# EAGLE design DIGISPARK_PRODUCTION_REV3 (EAGLE 9.6.2)
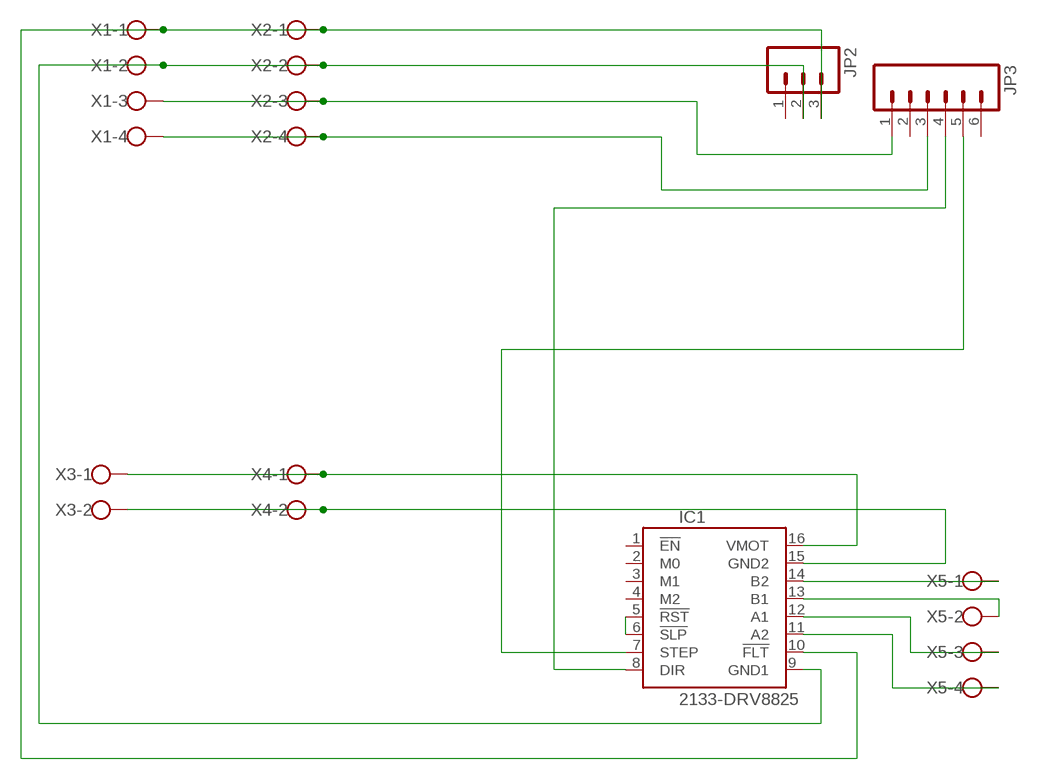
[diagram p0: schematic, sheet 1]

## Parts
IC1  2133-DRV8825  [DRV8825]
JP2  M03PTH  [1X03]
JP3  M06SIP  [1X06]
X1  W237-4  [W237-4]
X2  W237-4  [W237-4]
X3  W237-102  [W237-102]
X4  W237-102  [W237-102]
X5  W237-4  [W237-4]

## Nets
N$1: IC1.14(B2) X5.1
N$2: IC1.13(B1) X5.2
N$3: IC1.12(A1) X5.3
N$4: IC1.11(A2) X5.4
N$5: IC1.10(!FLT) JP2.3 X1.1 X2.1
N$6: IC1.9(GND1) JP2.2 X1.2 X2.2
N$7: JP3.1 X1.3 X2.3
N$8: JP3.3 X1.4 X2.4
N$9: IC1.16(VMOT) X3.1 X4.1
N$10: IC1.15(GND2) X3.2 X4.2
N$11: IC1.7(STEP) JP3.5
N$12: IC1.5(!RST) IC1.6(!SLP)
N$13: IC1.8(DIR) JP3.4
Unconnected: IC1.1(!EN) IC1.2(M0) IC1.3(M1) IC1.4(M2) JP2.1 JP3.2 JP3.6

## Library data of the parts
IC1 = pololu-stepper-driver:2133-DRV8825: DRV8825 Stepper Motor Driver Carrier, High Current #2133 DRV8825 Stepper Motor Driver Carrier; High Current <https://www.pololu.com/product/2133> in Japan, Suzaku Lab. Ltd. <https://suzakugiken.jp/> #2133 DRV8825 大電流用ステッピングモータドライバ <https://szc.jp/po2133>
JP2 = SparkFun:M03: Header 3 Standard 3-pin 0.1" header. Use with straight break away headers (SKU : PRT-00116), right angle break away headers (PRT-00553), swiss pins (PRT-00743), machine pins (PRT-00117), and female headers (PRT-00115). Molex polarized connector foot print use with SKU : PRT-08232 with associated crimp pins and housings.
JP3 = SparkFun:M06: Header 6 Standard 6-pin 0.1" header. Use with straight break away headers (SKU : PRT-00116), right angle break away headers (PRT-00553), swiss pins (PRT-00743), machine pins (PRT-00117), and female headers (PRT-00115). Molex polarized connector foot print use with SKU : PRT-08094 with associated crimp pins and housings. NOTES ON THE VARIANTS LOCK and LOCK_LONGPADS... This footprint was designed to help hold the alignment of a through-hole component (i.e. 6-pin header) while soldering it into place. You may notice that each hole has been shifted either up or down by 0.005 of an inch from it's more standard position (which is a perfectly straight line). This slight alteration caused the pins (the squares in the middle) to touch the edges of the holes. Because they are alternating, it causes a "brace" to hold the component in place. 0.005 has proven to be the perfect amount of "off-center" position when using our standard breakaway headers. Although looks a little odd when you look at the bare footprint, once you have a header in there, the alteration is very hard to notice. Also, if you push a header all the way into place, it is covered up entirely on the bottom side. This idea of altering the position of holes to aid alignment will be further integrated into the Sparkfun Library for other footprints. It can help hold any component with 3 or more connection pins.
X1 X2 X5 = con-wago-500:W237-4: WAGO SCREW CLAMP; OC_FARNELL: unknown; OC_NEWARK: unknown
X3 X4 = con-wago-500:W237-102: WAGO SCREW CLAMP; MPN: 237-102; OC_FARNELL: unknown; OC_NEWARK: 70K9898

## Board
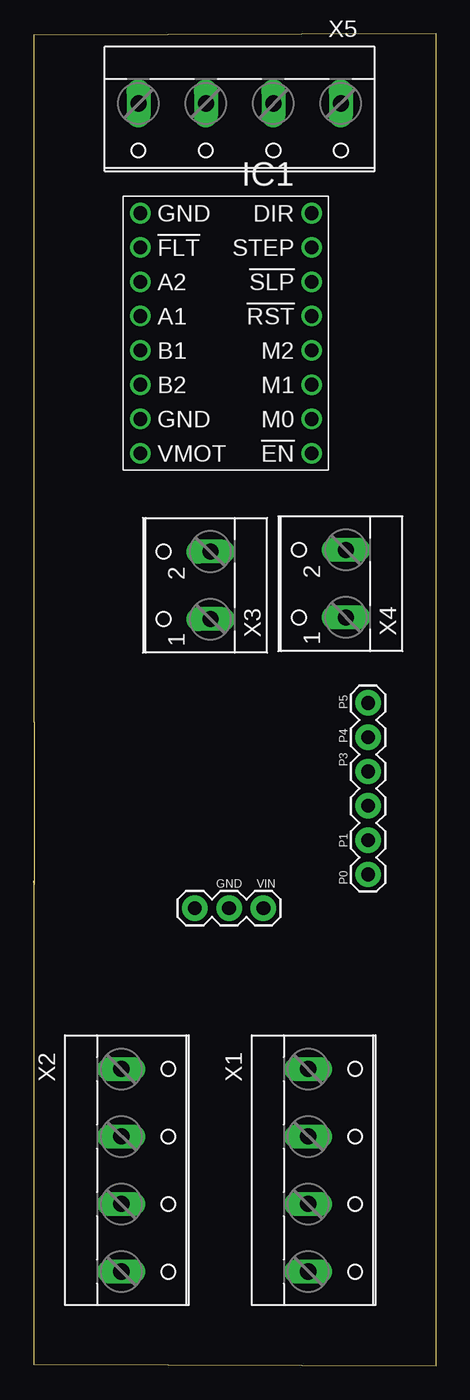
[diagram p1: board, top side]
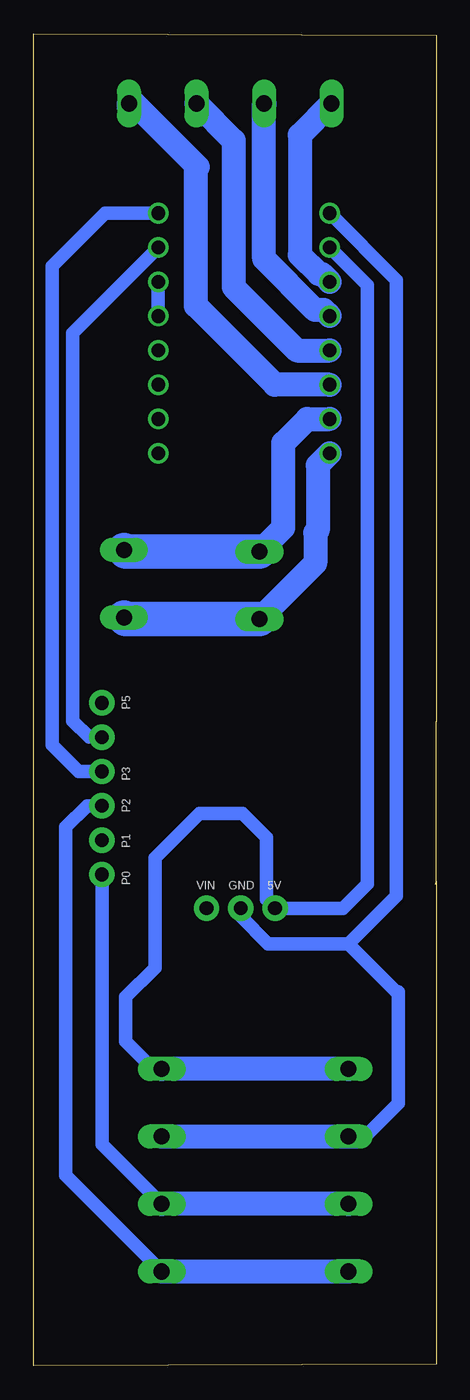
[diagram p2: board, bottom side, seen from below]

Size 29.82 x 98.63 mm. Coordinates in mm from the lower left corner, seen from the top.
Outline: 0.02,35.63 0,35.88 0,0.13 29.82,0 29.82,98.63 0,98.5 0,47.66 0.02,47.66 0.02,35.63
Copper layers (1*16): Top 0.0356mm / dielectric 1.5011mm / Bottom 0.0356mm
Design rules "default": minimum track width 8mil, minimum drill 13mil, track to track 12mil, track to pad 12mil, pad to pad 12mil, via to via 12mil, smd to smd 8mil, copper to edge 15mil, drill to drill 12mil, minimum pad ring 7mil, minimum via ring 7mil, stop-mask expansion 4mil, vias tented up to drill 25mil, thermal gap 10mil

### Footprints (pad centres in the part's own frame; a part is rotated, then mirrored left to right if it is on the bottom)
DRV8825 = drill 1.016: 1 -6.35,8.89; 2 -6.35,6.35; 3 -6.35,3.81; 4 -6.35,1.27; 5 -6.35,-1.27; 6 -6.35,-3.81; 7 -6.35,-6.35; 8 -6.35,-8.89; 9 6.35,-8.89; 10 6.35,-6.35; 11 6.35,-3.81; 12 6.35,-1.27; 13 6.35,1.27; 14 6.35,3.81; 15 6.35,6.35; 16 6.35,8.89
1X03 = drill 1.016 pad 1.88: 1 0,0; 2 2.54,0; 3 5.08,0
1X06 = drill 1.016 pad 1.88: 1 0,0; 2 2.54,0; 3 5.08,0; 4 7.62,0; 5 10.16,0; 6 12.7,0
W237-4 = drill 1.194 long: 1 -7.5,-1.27; 2 -2.5,-1.27; 3 2.5,-1.27; 4 7.5,-1.27
W237-102 = drill 1.194 long: 1 -2.5,-1.27; 2 2.5,-1.27

### Placement (x,y rotation side)
IC1  14.24,76.45 180 top
JP2  17.02,33.88 180 top
JP3  24.77,36.38 90 top
X1  21.61,14.48 270 top
X2  7.76,14.48 270 top
X3  11.83,57.78 90 top
X4  21.86,57.91 90 top
X5  15.26,92.2 180 top

### Tracks (layer width: path | path; a pad name or v marks a point on that pad's centre or on a via)
N$1
  Bottom 1.778: 22.76,93.22 X5.1 22.37,93.47 17.67,88.77 17.8,88.65 17.8,78.49 11.96,72.64 IC1.14
N$2
  Bottom 1.778: IC1.13 10.3,75.18 15,79.88 15,90.72 X5.2
N$3
  Bottom 1.778: 12.72,93.43 X5.3 12.76,81.96 8.98,78.18 8.35,78.18 IC1.12
N$4
  Bottom 1.778: X5.4 10.1,91.13 10.1,82.25 8.7,80.85 8.47,80.85 IC1.11
N$5
  Bottom 1.016: IC1.10 5.1,80.01 5.1,35.69 6.9,33.88 JP2.3 12.59,34.53 12.59,39.12 14.37,40.89 17.54,40.89 20.84,37.59 20.84,29.46 23,27.3 23,24 20.98,21.98 X1.1
  Bottom 1.778: X2.1 X1.1
N$6
  Bottom 1.016: IC1.9 2.94,80.39 2.94,34.8 6.49,31.24 | 6.49,31.24 12.46,31.24 14.48,33.26 JP2.2 | 6.49,31.24 2.94,27.69 2.81,27.69 2.81,19.43 5.26,16.98 5.99,16.98 X2.2
  Bottom 1.778: X1.2 5.99,16.98
N$7
  Bottom 1.016: X1.3 24.77,16.41 JP3.1
  Bottom 1.778: X2.3 X1.3
N$8
  Bottom 1.016: JP3.3 25.87,41.46 27.45,39.88 27.45,14.09 X1.4
  Bottom 1.778: X1.4 X2.4
N$9
  Bottom 1.778: IC1.16 8.78,66.67 8.78,61.84 8.96,61.66 8.96,59.42 X3.1
  Bottom 2.54: X4.1 23,55.28 X3.1
N$10
  Bottom 1.778: X3.2 11.32,62.06 11.32,68.33 9.54,70.1 IC1.15
  Bottom 2.54: X4.2 23,60.28 X3.2
N$11
  Bottom 1.016: JP3.5 25.73,46.54 26.94,47.75 26.94,76.45 IC1.7
N$12
  Bottom 1.016: IC1.6 IC1.5
N$13
  Bottom 1.016: JP3.4 26.49,44 28.46,45.97 28.46,81.41 24.53,85.34 IC1.8

### Text on the board
tNames: P5 | P4 | P3 | P1 | P0 | GND | VIN
bNames: P5 | P3 | P2 | P1 | P0 | 5V | GND | VIN